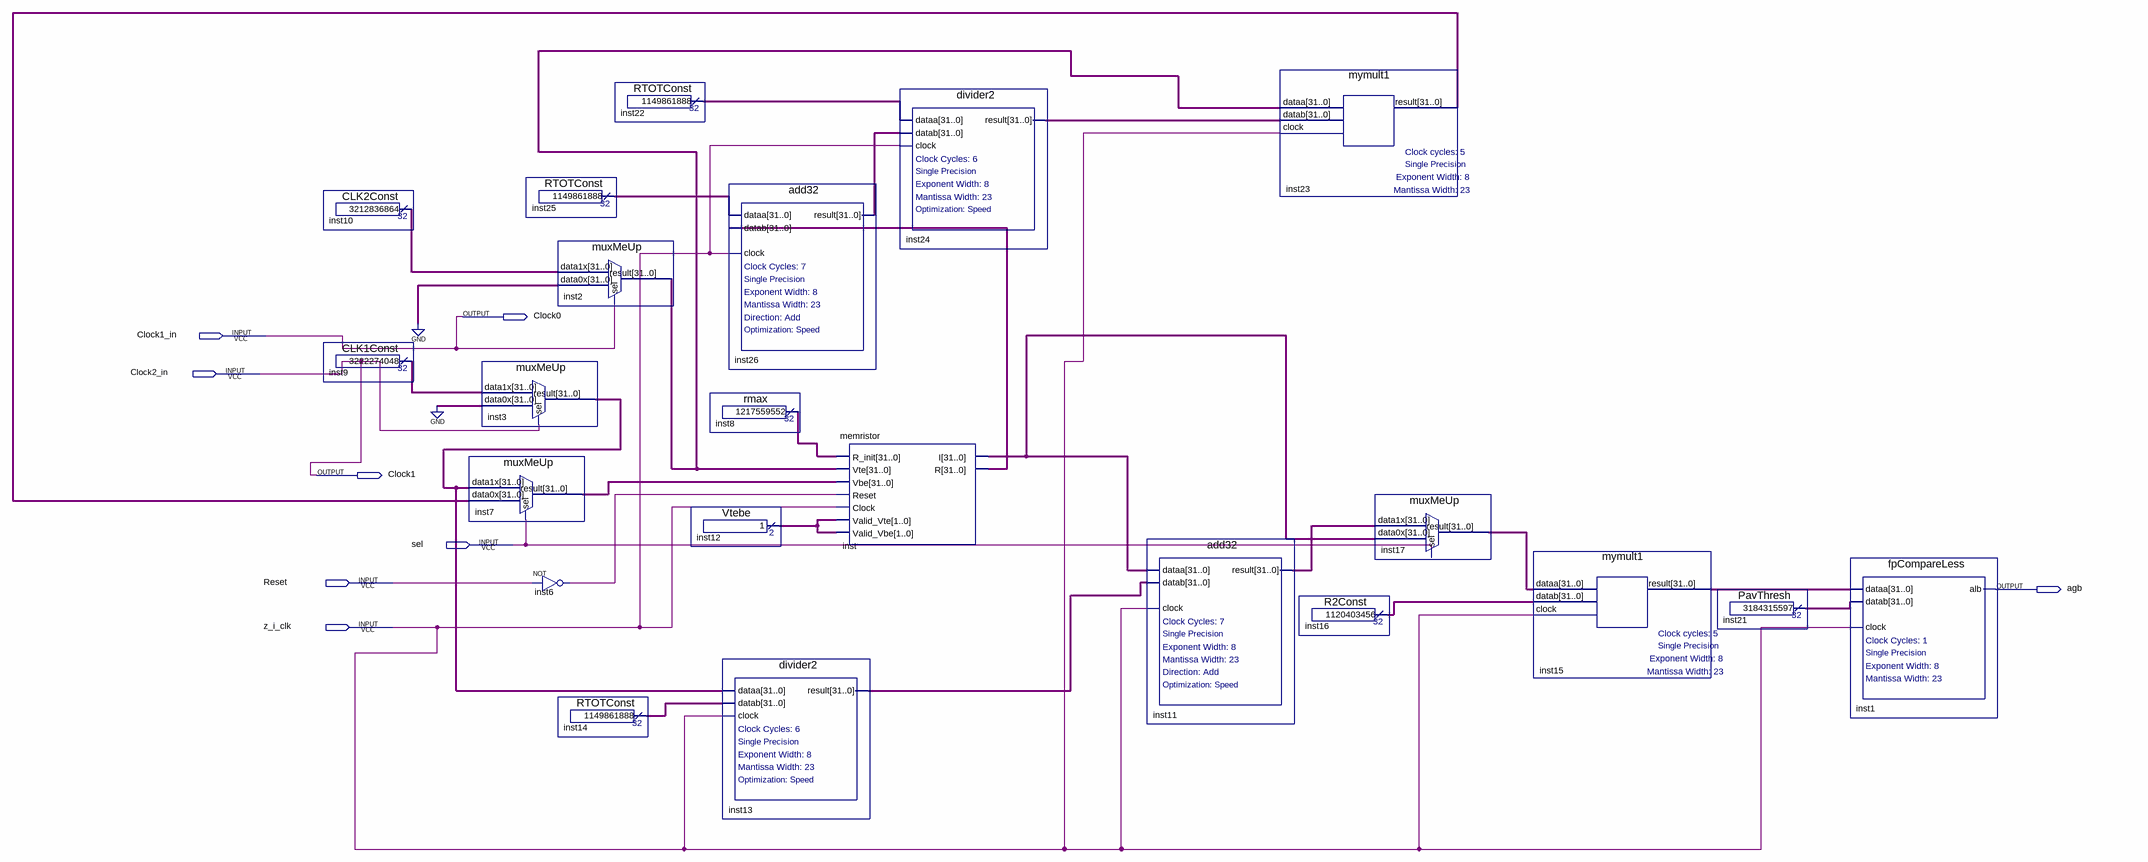
[diagram p0: schematic sheet]
// Quartus schematic pavDOGSIM.bdf as structural Verilog: 22 symbols, 8 pins
module pavDOGSIM (
  input  Clock1_in,
  input  Clock2_in,
  input  sel,
  input  Reset,
  input  z_i_clk,
  output Clock0,
  output Clock1,
  output agb
);

  wire inst6_out;
  wire [1:0] inst12_result;
  wire [31:0] inst2_result, inst3_result, inst7_result, inst8_result, inst9_result, inst10_result,
       inst11_result, inst13_result, inst14_result, inst15_result, inst16_result, inst17_result,
       inst21_result, inst22_result, inst23_result, inst24_result, inst25_result, inst26_result, inst_i,
       inst_r;

  CLK2Const inst10 (.result(inst10_result));
  CLK1Const inst9 (.result(inst9_result));
  muxMeUp inst7 (.data1x(inst3_result), .data0x(inst23_result), .sel(sel), .result(inst7_result));
  muxMeUp inst3 (.data1x(inst9_result), .data0x({32{1'b0}}), .sel(Clock2_in), .result(inst3_result));
  RTOTConst inst25 (.result(inst25_result));
  muxMeUp inst2 (.data1x(inst10_result), .data0x({32{1'b0}}), .sel(Clock1_in), .result(inst2_result));
  not inst6 (inst6_out, Reset);
  RTOTConst inst14 (.result(inst14_result));
  RTOTConst inst22 (.result(inst22_result));
  rmax inst8 (.result(inst8_result));
  Vtebe inst12 (.result(inst12_result));
  divider2 inst13 (.dataa(inst3_result), .datab(inst14_result), .clock(z_i_clk), .result(inst13_result));
  add32 inst26 (.dataa(inst25_result), .datab(inst_r), .clock(z_i_clk), .result(inst26_result));
  memristor inst (
    .Clock(z_i_clk), .R_init(inst8_result), .Reset(inst6_out), .Valid_Vbe(inst12_result),
    .Valid_Vte(inst12_result), .Vbe(inst7_result), .Vte(inst2_result), .I(inst_i), .R(inst_r));
  divider2 inst24 (.dataa(inst22_result), .datab(inst26_result), .clock(z_i_clk), .result(inst24_result));
  add32 inst11 (.dataa(inst_i), .datab(inst13_result), .clock(z_i_clk), .result(inst11_result));
  mymult1 inst23 (.dataa(inst2_result), .datab(inst24_result), .clock(z_i_clk), .result(inst23_result));
  R2Const inst16 (.result(inst16_result));
  muxMeUp inst17 (.data1x(inst11_result), .data0x(inst_i), .sel(sel), .result(inst17_result));
  mymult1 inst15 (.dataa(inst17_result), .datab(inst16_result), .clock(z_i_clk), .result(inst15_result));
  PavThresh inst21 (.result(inst21_result));
  fpCompareLess inst1 (.dataa(inst15_result), .datab(inst21_result), .clock(z_i_clk), .alb(agb));

  assign Clock0 = Clock1_in;
  assign Clock1 = Clock2_in;
endmodule
